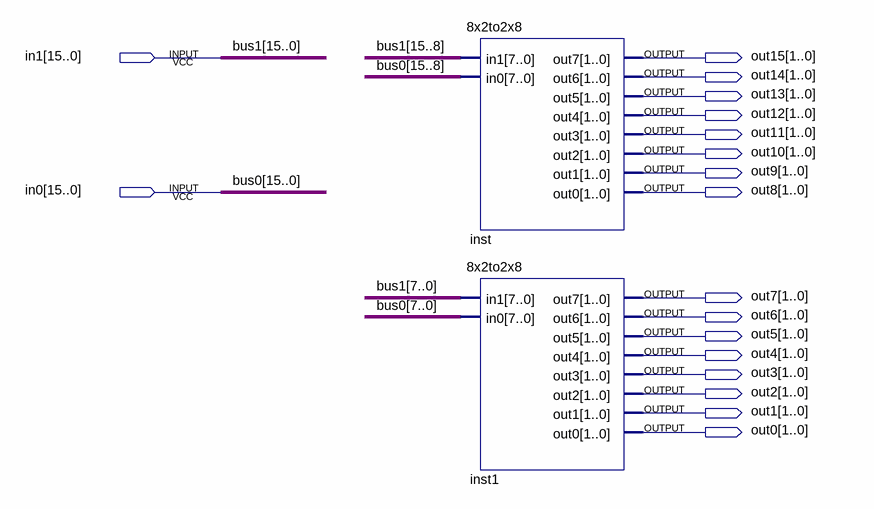
[diagram p0: schematic sheet]
// Quartus schematic 16x2to2x16.bdf as structural Verilog: 2 symbols, 18 pins
module \16x2to2x16  (
  input  [15:0] in1,
  input  [15:0] in0,
  output [1:0] out15,
  output [1:0] out14,
  output [1:0] out13,
  output [1:0] out12,
  output [1:0] out11,
  output [1:0] out10,
  output [1:0] out9,
  output [1:0] out8,
  output [1:0] out7,
  output [1:0] out6,
  output [1:0] out5,
  output [1:0] out4,
  output [1:0] out3,
  output [1:0] out2,
  output [1:0] out1,
  output [1:0] out0
);

  \8x2to2x8  inst (
    .in1(in1[15:8]), .in0(in0[15:8]), .out7(out15), .out6(out14), .out5(out13), .out4(out12), .out3(out11),
    .out2(out10), .out1(out9), .out0(out8));
  \8x2to2x8  inst1 (
    .in1(in1[7:0]), .in0(in0[7:0]), .out7(out7), .out6(out6), .out5(out5), .out4(out4), .out3(out3),
    .out2(out2), .out1(out1), .out0(out0));

  // Other names for the same wires on the sheet: bus0[15:0] = in0; bus1[15:0] = in1
endmodule
